# Altium schematic sheet 05_IO_CONN.SchDoc: IO CONN
size A4; Date: 20/11/2014; Author: HuangRui <vowstar@gmail.com>; DrawnBy: JiYaping <jyp1817@gmail.com>; Organization: WWW.NODEMCU.COM
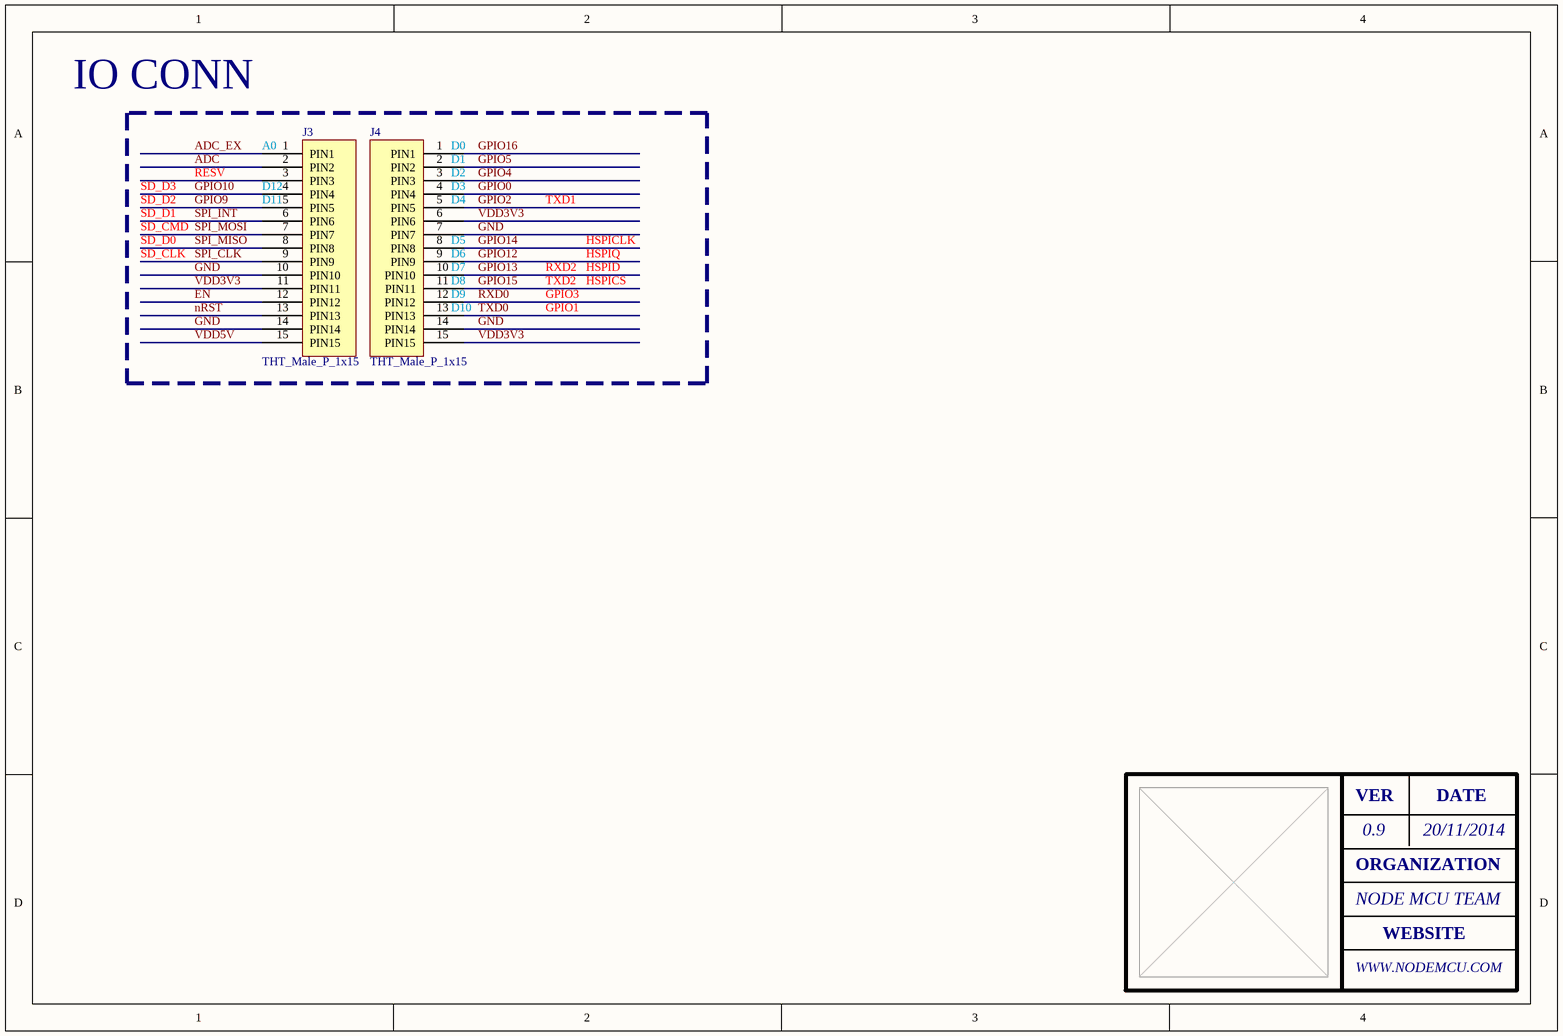
[diagram p0: 05_IO_CONN.SchDoc]

## Parts
J3  THT_Male_P_1x15  [THT_Male_P_1x15-2.54mm]
J4  THT_Male_P_1x15  [THT_Male_P_1x15-2.54mm]

## Nets
ADC: J3.2(PIN2)
ADC_EX: J3.1(PIN1)
EN: J3.12(PIN12)
GND: J3.10(PIN10) J3.14(PIN14) J4.7(PIN7) J4.14(PIN14)
GPIO0: J4.4(PIN4)
GPIO2: J4.5(PIN5)
GPIO4: J4.3(PIN3)
GPIO5: J4.2(PIN2)
GPIO9: J3.5(PIN5)
GPIO10: J3.4(PIN4)
GPIO12: J4.9(PIN9)
GPIO13: J4.10(PIN10)
GPIO14: J4.8(PIN8)
GPIO15: J4.11(PIN11)
GPIO16: J4.1(PIN1)
nRST: J3.13(PIN13)
RXD0: J4.12(PIN12)
SPI_CLK: J3.9(PIN9)
SPI_INT: J3.6(PIN6)
SPI_MISO: J3.8(PIN8)
SPI_MOSI: J3.7(PIN7)
TXD0: J4.13(PIN13)
VDD3V3: J3.11(PIN11) J4.6(PIN6) J4.15(PIN15)
VDD5V: J3.15(PIN15)

Not connected (* = marked no-connect by the designer): J3 3(PIN3)

## Notes on the sheet
- RESV
- (near J3) A0
- (near J4) D0
- (near J4) D1
- (near J4) D2
- SD_D0
- SD_CMD
- SD_D1
- SD_D3
- SD_D2
- (near J3) D12
- (near J3) D11
- (near J4) D3
- (near J4) D4
- (near J4) D5
- TXD1
- HSPICLK
- SD_CLK
- (near J4) D6
- (near J4) D7
- (near J4) D8
- (near J4) D9
- (near J4) D10
- TXD2
- RXD2
- GPIO3
- GPIO1
- HSPIQ
- HSPID
- HSPICS
- VER
- 0.9
- DATE
- ORGANIZATION
- NODE MCU TEAM
- WEBSITE

## Library data of the parts
J3 J4 = THT_Male_P_1x15: THT Male pin header strip 1x15